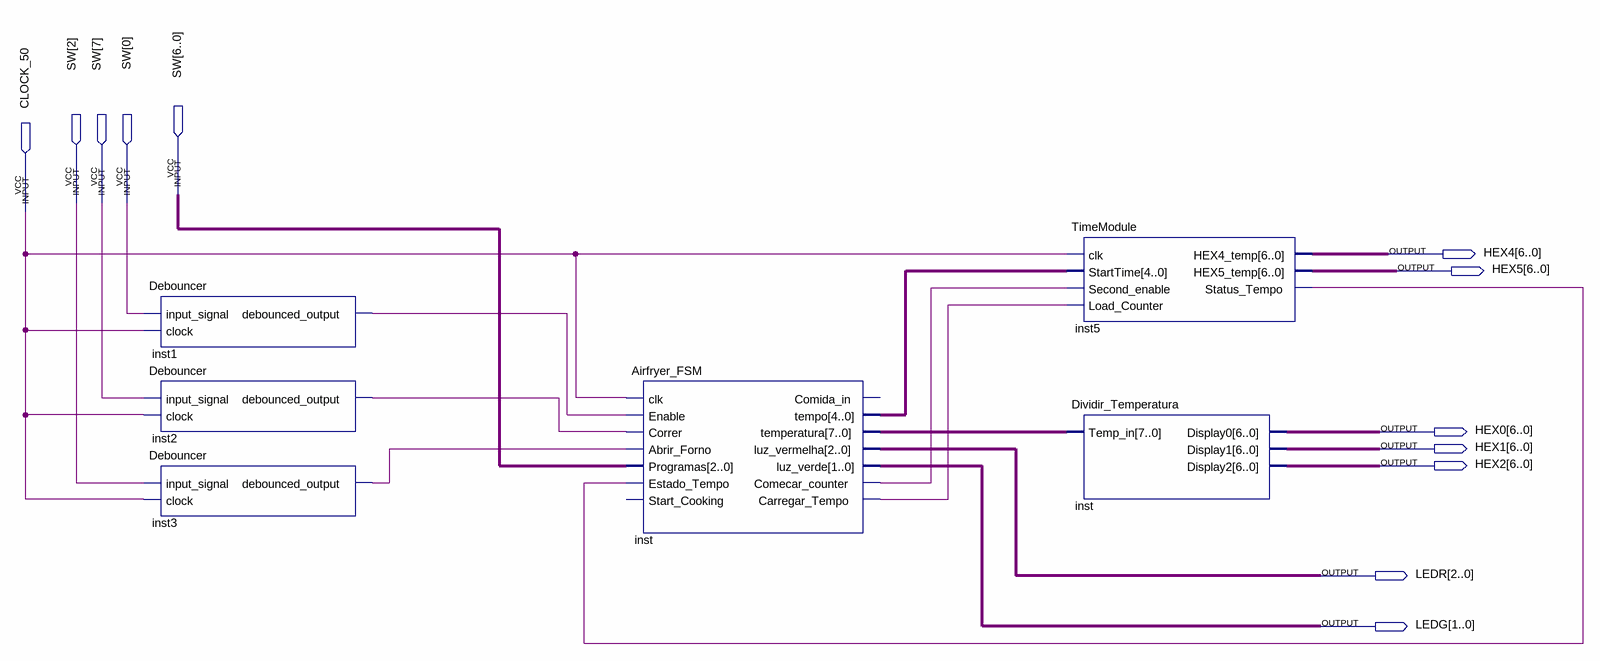
[diagram p0: schematic sheet]
// Quartus schematic apresentacao.bdf as structural Verilog: 6 symbols, 12 pins
module apresentacao (
  input  [7:0] SW,
  input  CLOCK_50,
  output [6:0] HEX4,
  output [6:0] HEX5,
  output [6:0] HEX0,
  output [6:0] HEX1,
  output [6:0] HEX2,
  output [2:0] LEDR,
  output [1:0] LEDG
);

  wire inst1_debounced_output, inst2_debounced_output, inst3_debounced_output, inst5_status_tempo,
       inst_carregar_tempo, inst_comecar_counter;
  wire [4:0] inst_tempo;
  wire [7:0] inst_temperatura;

  Debouncer inst1 (.input_signal(SW[0]), .clock(CLOCK_50), .debounced_output(inst1_debounced_output));
  Debouncer inst2 (.input_signal(SW[7]), .clock(CLOCK_50), .debounced_output(inst2_debounced_output));
  Debouncer inst3 (.input_signal(SW[2]), .clock(CLOCK_50), .debounced_output(inst3_debounced_output));
  Airfryer_FSM inst (
    .clk(CLOCK_50), .Enable(inst1_debounced_output), .Correr(inst2_debounced_output),
    .Abrir_Forno(inst3_debounced_output), .Programas(SW[6:0]), .Estado_Tempo(inst5_status_tempo),
    .tempo(inst_tempo), .temperatura(inst_temperatura), .luz_vermelha(LEDR), .luz_verde(LEDG),
    .Comecar_counter(inst_comecar_counter), .Carregar_Tempo(inst_carregar_tempo));  // open: Start_Cooking, Comida_in
  TimeModule inst5 (
    .clk(CLOCK_50), .StartTime(inst_tempo), .Second_enable(inst_comecar_counter),
    .Load_Counter(inst_carregar_tempo), .HEX4_temp(HEX4), .HEX5_temp(HEX5), .Status_Tempo(inst5_status_tempo));
  Dividir_Temperatura inst_dup2 (.Temp_in(inst_temperatura), .Display0(HEX0), .Display1(HEX1), .Display2(HEX2));
endmodule
